# EAGLE design Handschuh (EAGLE 6.5.0)
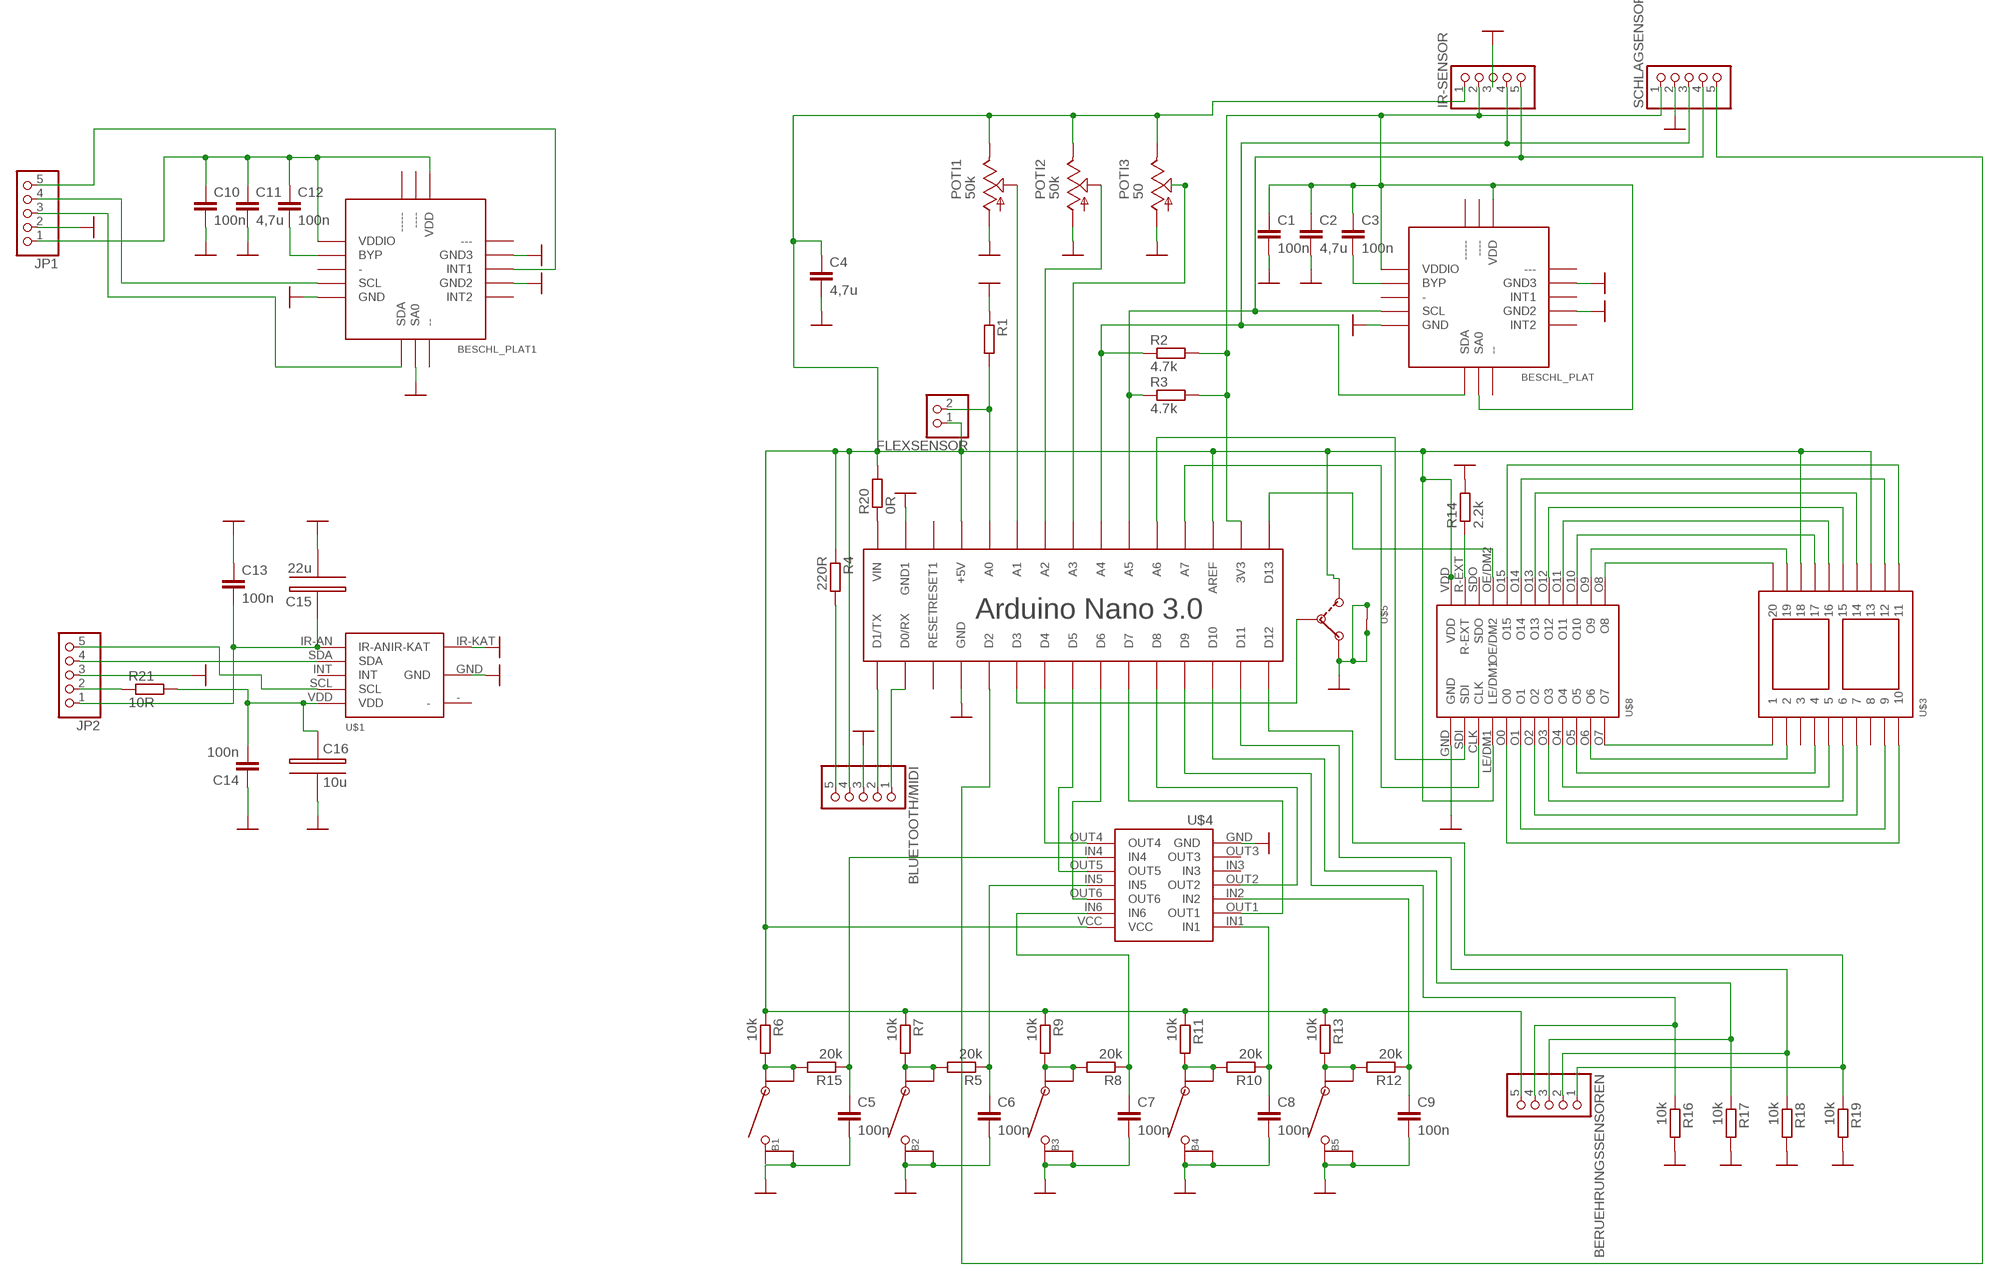
[diagram p0: schematic, sheet 1]

## Parts
B1  BUTTON  [BUTTON]
B2  BUTTON  [BUTTON]
B3  BUTTON  [BUTTON]
B4  BUTTON  [BUTTON]
B5  BUTTON  [BUTTON]
BERUEHRUNGSSENSOREN  PINHD-1X5/90  [1X05/90]
BESCHL_PLAT  BESCHLEUNIGSUNGSSENSOR  [BESCHLEUNIGUNGSSENSOR]
BESCHL_PLAT1  BESCHLEUNIGSUNGSSENSOR  [BESCHLEUNIGUNGSSENSOR]
BLUETOOTH/MIDI  PINHD-1X5/90  [1X05/90]
C1  100n  C-EUC0805  [C0805]
C2  4,7u  C-EUC0805  [C0805]
C3  100n  C-EUC0805  [C0805]
C4  4,7u  C-EUC0805  [C0805]
C5  100n  C-EUC0805  [C0805]
C6  100n  C-EUC0805  [C0805]
C7  100n  C-EUC0805  [C0805]
C8  100n  C-EUC0805  [C0805]
C9  100n  C-EUC0805  [C0805]
C10  100n  C-EUC0805  [C0805]
C11  4,7u  C-EUC0805  [C0805]
C12  100n  C-EUC0805  [C0805]
C13  100n  C-EUC0805  [C0805]
C14  100n  C-EUC0805  [C0805]
C15  22u  22U-KONDENSATOR  [22U-KONDENSATOR]
C16  10u  22U-KONDENSATOR  [22U-KONDENSATOR]
FLEXSENSOR  PINHD-1X2/90  [1X02/90]
IR-SENSOR  PINHD-1X5/90  [1X05/90]
JP1  PINHD-1X5/90  [1X05/90]
JP2  PINHD-1X5/90  [1X05/90]
POTI1  50k  POTI  [POTI]
POTI2  50k  POTI  [POTI]
POTI3  50  POTI  [POTI]
R1  R-EU_M0805  [M0805]
R2  4.7k  R-EU_M0805  [M0805]
R3  4.7k  R-EU_M0805  [M0805]
R4  220R  R-EU_M0805  [M0805]
R5  20k  R-EU_M0805  [M0805]
R6  10k  R-EU_M0805  [M0805]
R7  10k  R-EU_M0805  [M0805]
R8  20k  R-EU_M0805  [M0805]
R9  10k  R-EU_M0805  [M0805]
R10  20k  R-EU_M0805  [M0805]
R11  10k  R-EU_M0805  [M0805]
R12  20k  R-EU_M0805  [M0805]
R13  10k  R-EU_M0805  [M0805]
R14  2.2k  R-EU_M0805  [M0805]
R15  20k  R-EU_M0805  [M0805]
R16  10k  R-EU_M0805  [M0805]
R17  10k  R-EU_M0805  [M0805]
R18  10k  R-EU_M0805  [M0805]
R19  10k  R-EU_M0805  [M0805]
R20  0R  R-EU_M0805  [M0805]
R21  10R  R-EU_M0805  [M0805]
SCHLAGSENSOR  PINHD-1X5/90  [1X05/90]
U$1  IR-SENSOR  [IR-SENSOR]
U$2  ARDUINONANO  [PDIP-32]
U$3  7-SEGMENT  [7-SEGMENT]
U$4  SCHMITT-TRIGGER  [SCHMITT-TRIGGER]
U$5  SCHALTER  [SCHALTER]
U$8  7-SEGMENT-TREIBER  [7-SEGMENT-TREIBER]

## Nets
3,3V: BESCHL_PLAT.SA0 BESCHL_PLAT.VDD BESCHL_PLAT.VDDIO C1.1 C2.1 C3.1 IR-SENSOR.2 R2.2 R3.2 SCHLAGSENSOR.1 U$2.3V3
3,3V1: BESCHL_PLAT1.VDD BESCHL_PLAT1.VDDIO C10.1 C11.1 C12.1 JP1.1
5V: BERUEHRUNGSSENSOREN.5 BLUETOOTH/MIDI.4 C4.1 FLEXSENSOR.1 IR-SENSOR.1 POTI1.VCC POTI2.VCC POTI3.VCC R4.1 R6.1 R7.1 R9.1 R11.1 R13.1 R20.2 U$2.+5V U$2.AREF U$3.13 U$3.18 U$4.VCC U$5.3 U$8.LE/DM1 U$8.VDD
GND: B1.2 B2.2 B3.2 B4.2 B5.2 BESCHL_PLAT1.GND BESCHL_PLAT1.GND2 BESCHL_PLAT1.GND3 BESCHL_PLAT1.SA0 BESCHL_PLAT.GND BESCHL_PLAT.GND2 BESCHL_PLAT.GND3 BLUETOOTH/MIDI.3 C1.2 C2.2 C4.2 C5.2 C6.2 C7.2 C8.2 C9.2 C10.2 C11.2 C13.1 C14.1 C15.- C16.- IR-SENSOR.3 JP1.2 JP2.3 POTI1.GND POTI2.GND POTI3.GND R1.1 R14.2 R16.2 R17.2 R18.2 R19.2 SCHLAGSENSOR.2 U$1.GND U$1.IR-KAT U$2.GND U$2.GND1 U$4.GND U$5.1 U$5.4 U$5.5 U$8.GND
N$1: R20.1 U$2.VIN
N$2: BESCHL_PLAT1.BYP C12.2
N$3: B1.3 B1.4 R6.2 R15.2
N$4: FLEXSENSOR.2 R1.2 U$2.A0
N$5: BESCHL_PLAT.BYP C3.2
N$6: SCHLAGSENSOR.5 U$2.D2
N$7: POTI1.VALUE U$2.A1
N$8: POTI2.VALUE U$2.A2
N$9: POTI3.VALUE U$2.A3
N$10: BESCHL_PLAT1.SCL JP1.4
N$11: BLUETOOTH/MIDI.2 U$2.D1/TX
N$12: BLUETOOTH/MIDI.1 U$2.D0/RX
N$13: BLUETOOTH/MIDI.5 R4.2
N$14: BESCHL_PLAT1.SDA JP1.3
N$15: C6.1 R5.1 U$4.IN5
N$16: B2.3 B2.4 R5.2 R7.2
N$17: C7.1 R8.1 U$4.IN6
N$18: B3.3 B3.4 R8.2 R9.2
N$19: C8.1 R10.1 U$4.IN1
N$20: B4.3 B4.4 R10.2 R11.2
N$21: C9.1 R12.1 U$4.IN2
N$22: B5.3 B5.4 R12.2 R13.2
N$23: U$2.D4 U$4.OUT4
N$24: U$2.D5 U$4.OUT5
N$25: U$2.D6 U$4.OUT6
N$26: U$2.D7 U$4.OUT1
N$27: U$2.D8 U$4.OUT2
N$28: U$2.A6 U$8.SDI
N$29: C5.1 R15.1 U$4.IN4
N$30: U$2.A7 U$8.CLK
N$31: U$3.9 U$8.O1
N$32: U$3.1 U$8.O7
N$33: U$3.2 U$8.O6
N$34: U$3.4 U$8.O5
N$35: U$3.5 U$8.O4
N$36: U$3.6 U$8.O3
N$37: U$3.7 U$8.O2
N$38: U$3.10 U$8.O0
N$39: U$3.20 U$8.O8
N$40: U$3.19 U$8.O9
N$41: U$3.17 U$8.O10
N$42: U$3.16 U$8.O11
N$43: U$3.15 U$8.O12
N$44: U$3.14 U$8.O13
N$45: U$3.12 U$8.O14
N$46: U$3.11 U$8.O15
N$47: BERUEHRUNGSSENSOREN.4 R16.1 U$2.D9
N$48: R14.1 U$8.R-EXT
N$49: U$2.D13 U$8.OE/DM2
N$50: BESCHL_PLAT1.INT1 JP1.5
N$51: BERUEHRUNGSSENSOREN.3 R17.1 U$2.D10
N$52: BERUEHRUNGSSENSOREN.2 R18.1 U$2.D11
N$53: BERUEHRUNGSSENSOREN.1 R19.1 U$2.D12
N$54: U$2.D3 U$5.2
N$55: BESCHL_PLAT.SCL IR-SENSOR.5 R3.1 SCHLAGSENSOR.4 U$2.A5
N$56: C13.2 C15.+ JP2.1 U$1.IR-AN
N$57: C14.2 C16.+ R21.2 U$1.VDD
N$58: BESCHL_PLAT.SDA IR-SENSOR.4 R2.1 SCHLAGSENSOR.3 U$2.A4
N$59: JP2.2 R21.1
N$60: JP2.4 U$1.SDA
N$61: JP2.5 U$1.SCL
Unconnected: B1.1 B2.1 B3.1 B4.1 B5.1 BESCHL_PLAT1.- BESCHL_PLAT1.-- BESCHL_PLAT1.--- BESCHL_PLAT1.---- BESCHL_PLAT1.----- BESCHL_PLAT1.INT2 BESCHL_PLAT.- BESCHL_PLAT.-- BESCHL_PLAT.--- BESCHL_PLAT.---- BESCHL_PLAT.----- BESCHL_PLAT.INT1 BESCHL_PLAT.INT2 U$1.- U$1.INT U$2.RESET U$2.RESET1 U$3.3 U$3.8 U$4.IN3 U$4.OUT3 U$8.SDO

## Notes on the sheet
- Arduino Nano 3.0

## Library data of the parts
B1-B5 = Handschuh:BUTTON
BERUEHRUNGSSENSOREN BLUETOOTH/MIDI IR-SENSOR JP1 JP2 SCHLAGSENSOR = pinhead_wurz-kompatibel:PINHD-1X5: PIN HEADER
BESCHL_PLAT BESCHL_PLAT1 = beschleunigungssensor:BESCHLEUNIGSUNGSSENSOR
C1-C14 = rcl:C-EU: CAPACITOR, European symbol
C15 C16 = Handschuh:22U-KONDENSATOR
FLEXSENSOR = pinhead_wurz-kompatibel:PINHD-1X2: PIN HEADER
POTI1-POTI3 = Poti:POTI
R1-R21 = rcl:R-EU_: RESISTOR, European symbol
U$1 = Handschuh:IR-SENSOR
U$2 = jet-lib2:ARDUINONANO
U$3 = Handschuh:7-SEGMENT
U$4 = Handschuh:SCHMITT-TRIGGER
U$5 = Handschuh:SCHALTER
U$8 = Handschuh:7-SEGMENT-TREIBER

## Board
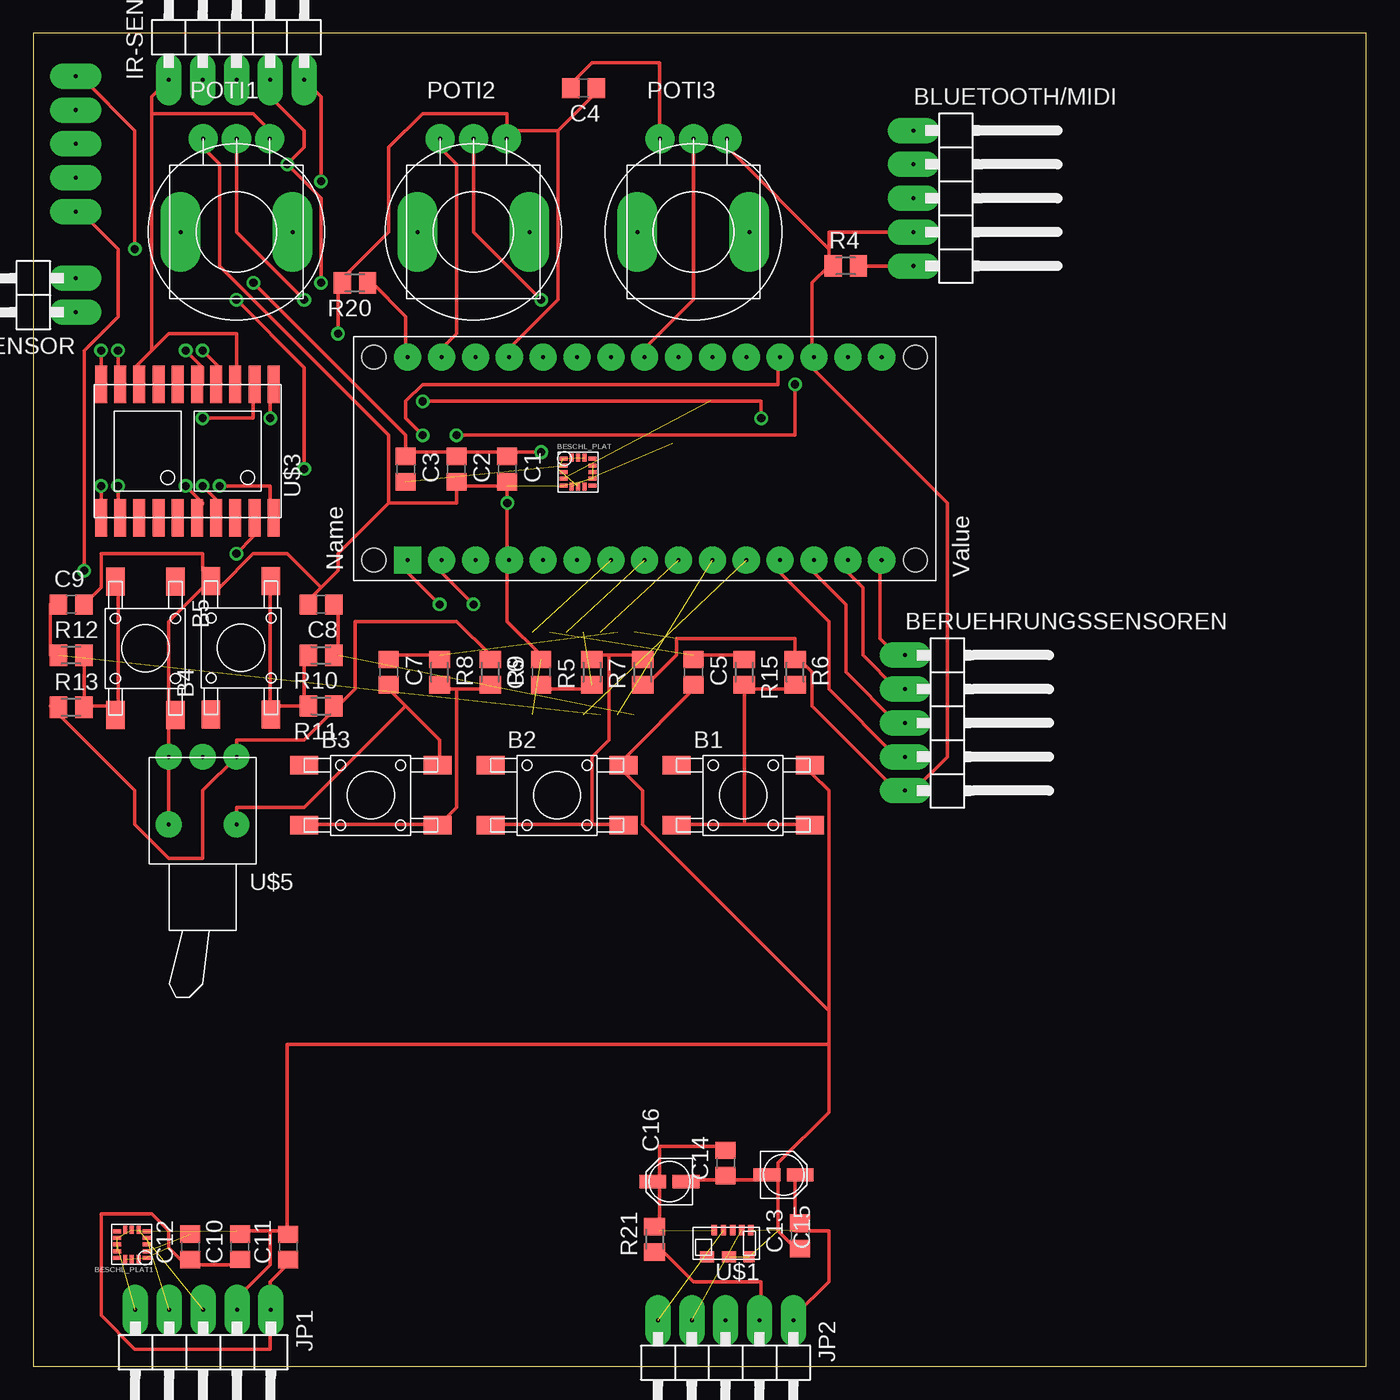
[diagram p1: board, top side]
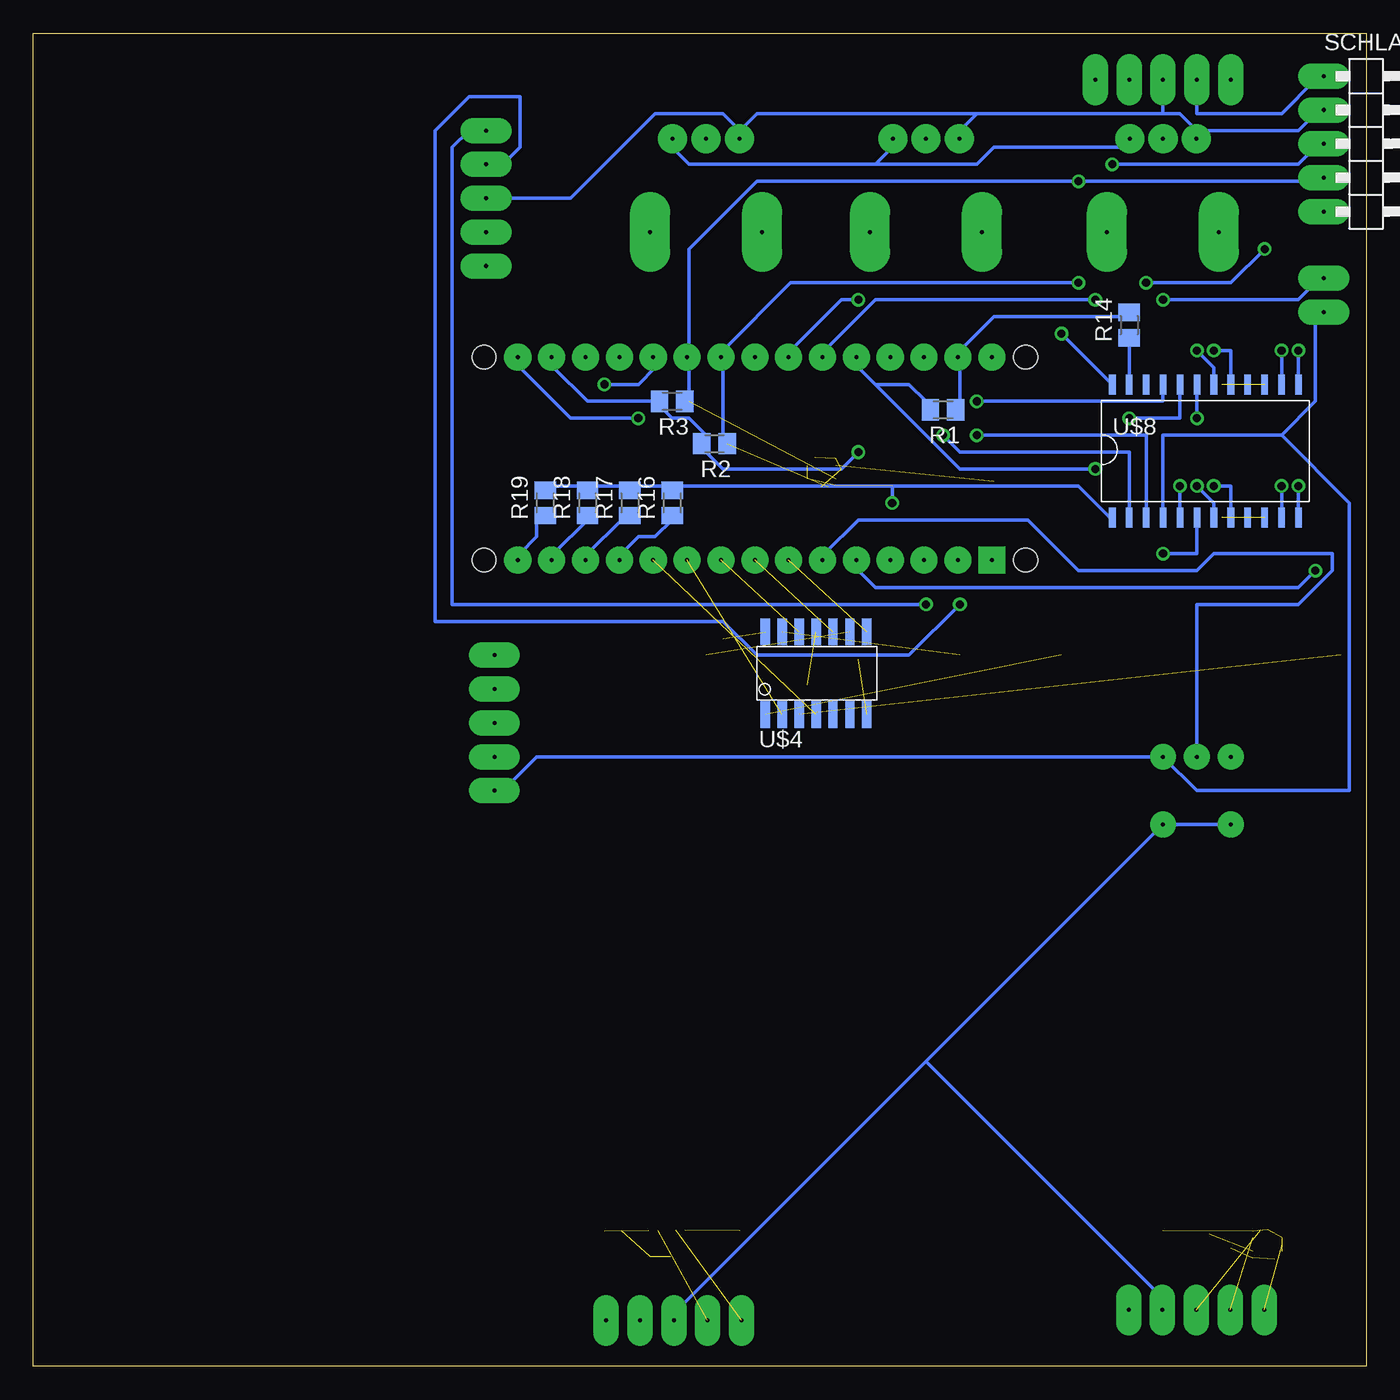
[diagram p2: board, bottom side, seen from below]

Size 100 x 100 mm. Coordinates in mm from the lower left corner, seen from the top.
Outline: 0,0 100,0 100,100 0,100 0,0
Copper layers (1*16): Top 0.035mm / dielectric 1.5mm / Bottom 0.035mm
Design rules "default *": minimum track width 10mil, minimum drill 24mil, track to track 8mil, track to pad 8mil, pad to pad 5mil, via to via 8mil, smd to smd 8mil, copper to edge 40mil, drill to drill 8mil, minimum pad ring 10mil, minimum via ring 8mil, stop-mask expansion 4mil, vias tented up to drill 0mil, thermal gap 10mil

### Footprints (pad centres in the part's own frame; a part is rotated, then mirrored left to right if it is on the bottom)
BUTTON = smd 2.1 x 1.4: 1 0,0; 2 10,0; 3 0,-4.5; 4 10,-4.5
1X05/90 = drill 0.305 pad 1.93 long: 1 -5.08,-3.81; 2 -2.54,-3.81; 3 0,-3.81; 4 2.54,-3.81; 5 5.08,-3.81
BESCHLEUNIGUNGSSENSOR = smd 0.61 x 0.305: - 0.4,-1.5; --- 2.6,-0.5; BYP 0.4,-1; GND 0.4,-2.5; GND2 2.6,-2; GND3 2.6,-1; INT1 2.6,-1.5; INT2 2.6,-2.5; SCL 0.4,-2; VDDIO 0.4,-0.5 | smd 0.305 x 0.61: -- 2,-2.6; ---- 1.5,-0.4; ----- 1,-0.4; SA0 1.5,-2.6; SDA 1,-2.6; VDD 2,-0.4
C0805 = smd 1.3 x 1.5: 1 -0.95,0; 2 0.95,0
22U-KONDENSATOR = smd 1 x 2: + 0,-0.5; - 0,-3
1X02/90 = drill 0.305 pad 1.93 long: 1 -1.27,-3.81; 2 1.27,-3.81
POTI = drill 0.305 pad 3 long: FIX1 -4.2,0; FIX2 4.2,0 | drill 0.305 pad 2.184: GND -2.5,7; VALUE 0,7; VCC 2.5,7
M0805 = smd 1.3 x 1.6: 1 -0.95,0; 2 0.95,0
IR-SENSOR = smd 1.05 x 0.8: - 3.925,-0.2; GND 2.275,-0.2 | smd 0.4 x 0.8: INT 2.02,-2.2; IR-AN 0.65,-2.2; SCL 2.705,-2.2; SDA 1.335,-2.2; VDD 3.39,-2.2 | smd 0.83 x 0.8: IR-KAT 0.785,-0.2
PDIP-32 = drill 0.305 pad 2.032: 3V3 15.24,-35.56; +5V 15.24,-10.16; A0 15.24,-12.7; A1 15.24,-15.24; A2 15.24,-17.78; A3 15.24,-20.32; A4 15.24,-22.86; A5 15.24,-25.4; A6 15.24,-27.94; A7 15.24,-30.48; AREF 15.24,-33.02; D0/RX 0,-5.08; D2 0,-12.7; D3 0,-15.24; D4 0,-17.78; D5 0,-20.32; D6 0,-22.86; D7 0,-25.4; D8 0,-27.94; D9 0,-30.48; D10 0,-33.02; D11 0,-35.56; D12 0,-38.1; D13 15.24,-38.1; GND 0,-10.16; GND1 15.24,-5.08; RESET 0,-7.62; RESET1 15.24,-7.62; VIN 15.24,-2.54 | drill 0.305 pad 2.032 square: D1/TX 0,-2.54 | hole 1.778: 0,0; 0,-40.64; 15.24,-40.64; 15.24,0
7-SEGMENT = smd 0.9 x 2.8: 1 0,-10; 2 1.44,-10; 3 2.88,-10; 4 4.32,-10; 5 5.76,-10; 6 7.2,-10; 7 8.64,-10; 8 10.08,-10; 9 11.52,-10; 10 12.96,-10; 11 12.96,0; 12 11.52,0; 13 10.08,0; 14 8.64,0; 15 7.2,0; 16 5.76,0; 17 4.32,0; 18 2.88,0; 19 1.44,0; 20 0,0
SCHMITT-TRIGGER = smd 0.7 x 2: GND 7.62,0; IN1 0,0; IN2 2.54,0; IN3 5.08,0; IN4 6.35,6.2; IN5 3.81,6.2; IN6 1.27,6.2; OUT1 1.27,0; OUT2 3.81,0; OUT3 6.35,0; OUT4 7.62,6.2; OUT5 5.08,6.2; OUT6 2.54,6.2; VCC 0,6.2
SCHALTER = drill 0.305 pad 1.93: 1 -2.54,2.54; 2 0,2.54; 3 2.54,2.54; 4 -2.54,-2.54; 5 2.54,-2.54
7-SEGMENT-TREIBER = smd 0.5 x 1.5: CLK -11.43,-10; GND -13.97,-10; LE/DM1 -10.16,-10; O0 -8.89,-10; O1 -7.62,-10; O2 -6.35,-10; O3 -5.08,-10; O4 -3.81,-10; O5 -2.54,-10; O6 -1.27,-10; O7 0,-10; O8 0,0; O9 -1.27,0; O10 -2.54,0; O11 -3.81,0; O12 -5.08,0; O13 -6.35,0; O14 -7.62,0; O15 -8.89,0; OE/DM2 -10.16,0; R-EXT -12.7,0; SDI -12.7,-10; SDO -11.43,0; VDD -13.97,0

### Placement (x,y rotation side)
B1  48.26,45.09 0 top
B2  34.29,45.09 0 top
B3  20.32,45.09 0 top
B4  13.34,48.9 90 top
B5  10.66,58.85 270 top
BERUEHRUNGSSENSOREN  69.22,48.26 270 top
BESCHL_PLAT  39.37,68.58 0 top
BESCHL_PLAT1  8.9,7.63 180 top
BLUETOOTH/MIDI  69.85,87.63 270 top
C1  35.56,67.31 270 top
C2  31.75,67.31 270 top
C3  27.94,67.31 270 top
C4  41.27,95.89 180 top
C5  49.53,52.07 270 top
C6  38.1,52.07 90 top
C7  26.67,52.07 270 top
C8  21.59,57.15 180 top
C9  2.84,57.15 0 top
C10  15.5,8.97 90 top
C11  19.12,8.95 90 top
C12  11.78,8.96 90 top
C13  57.53,9.78 90 top
C14  51.94,15.24 90 top
C15  58.04,14.35 270 top
C16  45.97,13.84 90 top
FLEXSENSOR  -0.64,80.35 90 top
IR-SENSOR  15.24,100.33 0 top
JP1  12.74,0.41 180 top
JP2  51.94,-0.38 180 top
POTI1  15.24,85.09 0 top
POTI2  33.02,85.09 0 top
POTI3  49.53,85.09 0 top
R1  31.75,71.75 180 bottom
R2  48.9,69.22 180 bottom
R3  52.07,72.39 180 bottom
R4  60.96,82.55 0 top
R5  41.91,52.07 90 top
R6  57.15,52.07 270 top
R7  45.72,52.07 90 top
R8  30.48,52.07 270 top
R9  34.29,52.07 270 top
R10  21.59,53.34 180 top
R11  21.59,49.53 180 top
R12  2.84,53.34 0 top
R13  2.84,49.43 0 top
R14  17.78,78.11 90 bottom
R15  53.34,52.07 270 top
R16  52.07,64.77 90 bottom
R17  55.24,64.77 90 bottom
R18  58.42,64.77 90 bottom
R19  61.59,64.77 90 bottom
R20  24.13,81.28 180 top
R21  46.61,9.53 90 top
SCHLAGSENSOR  -0.64,91.71 270 bottom
U$1  54.48,8 180 top
U$2  25.55,60.47 90 top
U$3  5.08,73.66 0 top
U$4  45.09,48.9 0 bottom
U$5  12.7,43.18 0 top
U$8  5.08,73.66 0 bottom

### Tracks (layer width: path | path; a pad name or v marks a point on that pad's centre or on a via)
3,3V  (via drill 0.61)  (3 unrouted)
  Top 0.254: 31.75,68.58 27.94,68.58 | 31.75,68.58 35.56,68.58 | 31.75,68.58 C2.1 | v38.1,68.58 35.56,68.58 | 35.56,68.58 C1.1 | v7.62,83.82 7.62,92.71 3.81,96.52 SCHLAGSENSOR.1 | v16.51,81.28 27.94,69.85 27.94,68.58 | 27.94,68.58 C3.1
  Bottom 0.254: IR-SENSOR.2 12.7,93.98 6.35,93.98 3.81,96.52 SCHLAGSENSOR.1 | 53.34,72.39 52.07,71.12 50.8,71.12 49.53,69.85 R2.2 49.53,68.58 48.26,67.31 39.37,67.31 v38.1,68.58 | 53.34,72.39 58.42,72.39 60.96,74.93 U$2.3V3 | 53.34,72.39 R3.2 | v7.62,83.82 10.16,81.28 v16.51,81.28
3,3V1  (2 unrouted)
  Top 0.254: 11.43,7.62 15.24,7.62 C10.1 | C11.1 19.05,7.62 17.78,6.35 17.78,5.08 JP1.1 17.78,3.81 17.78,1.27 7.62,1.27 5.08,3.81 5.08,11.43 8.89,11.43 10.16,10.16 10.16,8.89 11.43,7.62 | 11.43,7.62 C12.1
5V  (via drill 0.61)  (1 unrouted)
  Top 0.254: 8.89,76.2 10.16,77.47 15.24,77.47 15.24,73.66 U$3.13 | 8.89,76.2 7.62,74.93 7.62,73.66 U$3.18 | IR-SENSOR.1 8.89,95.25 8.89,93.98 | 8.89,76.2 8.89,93.98 | 8.89,93.98 16.51,93.98 17.78,92.71 POTI1.VCC | 59.69,82.55 58.42,81.28 58.42,76.2 U$2.AREF 58.42,74.93 68.58,64.77 68.58,45.72 66.04,43.18 BERUEHRUNGSSENSOREN.5 64.77,43.18 58.42,49.53 58.42,52.07 57.15,53.34 | BLUETOOTH/MIDI.4 59.69,85.09 59.69,83.82 | 59.69,82.55 59.69,83.82 | 59.69,82.55 R4.1 | 59.69,83.82 52.07,91.44 POTI3.VCC | 22.86,81.28 v22.86,77.47 | 39.37,92.71 41.91,95.25 C4.1 | 35.56,92.71 39.37,92.71 | 39.37,92.71 39.37,80.01 35.56,76.2 U$2.+5V | 22.86,81.28 26.67,85.09 26.67,91.44 29.21,93.98 35.56,93.98 35.56,92.71 | 22.86,81.28 R20.2 | 35.56,92.71 POTI2.VCC | 57.15,53.34 57.15,54.61 48.26,54.61 48.26,53.34 45.72,50.8 R7.1 | 57.15,53.34 R6.1 | R13.1 1.27,49.53 7.62,43.18 7.62,40.64 10.16,38.1 12.7,38.1 12.7,43.18 U$5.3 15.24,46.99 20.32,46.99 22.86,49.53 | 22.86,49.53 24.13,50.8 24.13,55.88 31.75,55.88 34.29,53.34 R9.1 | 22.86,49.53 R11.1
  Bottom 0.254: v22.86,77.47 U$8.VDD | 36.83,90.17 50.8,90.17 52.07,91.44 POTI3.VCC | 36.83,90.17 35.56,91.44 POTI2.VCC | 36.83,90.17 29.21,90.17 27.94,91.44 17.78,91.44 POTI1.VCC | 6.35,69.85 15.24,69.85 U$8.LE/DM1 15.24,63.5 | 6.35,69.85 3.81,72.39 3.81,78.74 FLEXSENSOR.1 | 6.35,69.85 1.27,64.77 1.27,43.18 12.7,43.18 U$5.3 62.23,45.72 64.77,43.18 BERUEHRUNGSSENSOREN.5
GND  (via drill 0.61)  (10 unrouted)
  Top 0.254: C4.2 40.64,96.52 41.91,97.79 46.99,97.79 46.99,92.71 POTI3.GND | U$2.GND1 30.48,76.2 31.75,77.47 31.75,90.17 30.48,91.44 POTI2.GND | C5.2 49.53,50.8 44.45,45.72 B2.2 44.45,44.45 45.72,43.18 45.72,40.64 59.69,26.67 | 52.07,13.97 49.53,13.97 C16.- | 55.88,13.97 55.88,10.16 57.15,8.89 C13.1 | 59.69,24.13 59.69,19.05 55.88,15.24 55.88,13.97 | 59.69,24.13 59.69,26.67 | 59.69,26.67 59.69,43.18 58.42,44.45 B1.2 | 55.88,13.97 C15.- 54.61,13.97 52.07,13.97 | 52.07,13.97 C14.1 | C6.2 38.1,53.34 35.56,55.88 35.56,59.69 U$2.GND 35.56,60.96 v35.56,64.77 35.56,66.04 | 21.59,58.42 22.86,59.69 22.86,60.96 26.67,64.77 | 21.59,58.42 20.32,57.15 C8.2 | 26.67,64.77 31.75,64.77 31.75,66.04 | 31.75,66.04 35.56,66.04 | 31.75,66.04 C2.2 | 35.56,66.04 C1.2 | 19.05,10.16 17.78,10.16 | 17.78,10.16 15.24,10.16 C10.2 | 17.78,10.16 17.78,7.62 15.24,5.08 JP1.2 | C9.2 3.81,57.15 5.08,58.42 5.08,60.96 12.7,60.96 12.7,59.69 B4.2 | 27.94,49.53 30.48,46.99 30.48,45.72 B3.2 | 27.94,49.53 26.67,50.8 C7.2 | U$5.4 U$5.1 10.16,48.26 B5.2 10.16,49.53 10.16,55.88 12.7,58.42 B4.2 | 27.94,49.53 20.32,41.91 15.24,41.91 U$5.5 | 21.59,58.42 19.05,60.96 16.51,60.96 13.97,58.42 B4.2 | 59.69,24.13 19.05,24.13 19.05,10.16 | 19.05,10.16 C11.2 | 26.67,64.77 26.67,69.85 13.97,82.55 13.97,90.17 12.7,91.44 POTI1.GND
  Bottom 0.254: BLUETOOTH/MIDI.3 59.69,87.63 53.34,93.98 48.26,93.98 46.99,92.71 | R14.2 17.78,78.74 27.94,78.74 30.48,76.2 U$2.GND1 30.48,74.93 30.48,72.39 R1.1 | 12.7,92.71 5.08,92.71 3.81,93.98 SCHLAGSENSOR.2 | 15.24,93.98 IR-SENSOR.3 | 15.24,93.98 13.97,93.98 12.7,92.71 | 12.7,92.71 POTI1.GND | 29.21,93.98 30.48,92.71 POTI2.GND | 15.24,93.98 29.21,93.98 | 46.99,92.71 45.72,93.98 29.21,93.98 | 46.99,92.71 POTI3.GND | 58.42,66.04 55.88,66.04 R17.2 54.61,66.04 52.07,66.04 | 58.42,66.04 60.96,66.04 R19.2 | 58.42,66.04 R18.2 | 52.07,66.04 35.56,66.04 | 35.56,66.04 21.59,66.04 19.05,63.5 U$8.GND | 52.07,66.04 R16.2 | U$5.4 U$5.5 33.02,22.86 | 33.02,22.86 52.07,3.81 JP2.3 | 33.02,22.86 15.24,5.08 JP1.2 | v35.56,64.77 35.56,66.04
N$1
  Top 0.254: R20.1 25.4,81.28 27.94,78.74 27.94,76.2 U$2.VIN
N$2  (1 unrouted)
N$3
  Top 0.254: 53.34,50.8 57.15,50.8 R6.2 | 53.34,40.64 58.42,40.64 B1.4 | 53.34,40.64 48.26,40.64 B1.3 | 53.34,40.64 53.34,50.8 | 53.34,50.8 R15.2
N$4  (via drill 0.61)
  Top 0.254: v15.24,80.01 20.32,74.93 v20.32,67.31
  Bottom 0.254: 36.83,73.66 34.29,73.66 33.02,72.39 R1.2 | 36.83,73.66 38.1,74.93 U$2.A0 | v15.24,80.01 5.08,80.01 3.81,81.28 FLEXSENSOR.2 | v20.32,67.31 30.48,67.31 36.83,73.66
N$5  (1 unrouted)
N$6  (via drill 0.61)
  Top 0.254: v3.81,59.69 3.81,76.2 6.35,78.74 6.35,83.82 3.81,86.36 SCHLAGSENSOR.5
  Bottom 0.254: v3.81,59.69 5.08,58.42 36.83,58.42 38.1,59.69 U$2.D2
N$7  (via drill 0.61)
  Top 0.254: v20.32,80.01 15.24,85.09 POTI1.VALUE
  Bottom 0.254: v20.32,80.01 36.83,80.01 40.64,76.2 U$2.A1
N$8  (via drill 0.61)
  Top 0.254: v38.1,80.01 33.02,85.09 POTI2.VALUE
  Bottom 0.254: v38.1,80.01 39.37,80.01 43.18,76.2 U$2.A2
N$9
  Top 0.254: POTI3.VALUE 49.53,80.01 45.72,76.2 U$2.A3
N$10  (1 unrouted)
N$11  (via drill 0.61)
  Top 0.254: v30.48,57.15 27.94,59.69 U$2.D1/TX
  Bottom 0.254: BLUETOOTH/MIDI.2 64.77,90.17 63.5,91.44 63.5,95.25 67.31,95.25 69.85,92.71 69.85,55.88 48.26,55.88 45.72,53.34 34.29,53.34 v30.48,57.15
N$12  (via drill 0.61)
  Top 0.254: v33.02,57.15 30.48,59.69 U$2.D0/RX
  Bottom 0.254: BLUETOOTH/MIDI.1 67.31,92.71 68.58,91.44 68.58,57.15 v33.02,57.15
N$13
  Top 0.254: BLUETOOTH/MIDI.5 R4.2
N$14  (1 unrouted)
N$15  (1 unrouted)
  Top 0.254: C6.1 38.1,50.8 41.91,50.8 R5.1
N$16
  Top 0.254: 43.18,53.34 45.72,53.34 R7.2 | 43.18,53.34 41.91,53.34 R5.2 | 41.91,40.64 44.45,40.64 B2.4 | 41.91,40.64 34.29,40.64 B2.3 | 43.18,53.34 43.18,46.99 41.91,45.72 41.91,40.64
N$17  (1 unrouted)
  Top 0.254: C7.1 26.67,53.34 30.48,53.34 R8.1
N$18
  Top 0.254: 31.75,50.8 34.29,50.8 R9.2 | 31.75,50.8 30.48,50.8 R8.2 | 30.48,40.64 20.32,40.64 B3.3 | 31.75,50.8 31.75,41.91 30.48,40.64 | 30.48,40.64 B3.4
N$19  (1 unrouted)
  Top 0.254: C8.1 22.86,57.15 22.86,53.34 R10.1
N$20
  Top 0.254: 17.78,49.53 20.32,49.53 | 20.32,49.53 20.32,53.34 R10.2 | 20.32,49.53 R11.2 | 17.78,49.53 17.78,58.42 B4.4 | 17.78,49.53 B4.3
N$21  (1 unrouted)
  Top 0.254: C9.1 1.27,57.15 1.27,53.34 R12.1
N$22
  Top 0.254: 6.35,49.53 3.81,49.53 | 3.81,49.53 3.81,53.34 R12.2 | 3.81,49.53 R13.2 | 6.35,49.53 6.35,58.42 B5.3 | 6.35,49.53 B5.4
N$23  (1 unrouted)
N$24  (1 unrouted)
N$25  (1 unrouted)
N$26  (1 unrouted)
N$27  (1 unrouted)
N$28  (via drill 0.61)
  Top 0.254: v31.75,69.85 57.15,69.85 v57.15,73.66
  Bottom 0.254: v31.75,69.85 30.48,68.58 17.78,68.58 U$8.SDI 17.78,63.5 | v57.15,73.66 54.61,73.66 53.34,74.93 U$2.A6
N$29  (1 unrouted)
  Top 0.254: C5.1 49.53,53.34 53.34,53.34 R15.1
N$30  (via drill 0.61)
  Top 0.254: v29.21,69.85 27.94,71.12 27.94,72.39 29.21,73.66 55.88,73.66 55.88,74.93 U$2.A7
  Bottom 0.254: v29.21,69.85 16.51,69.85 U$8.CLK 16.51,63.5
N$31  (via drill 0.61)
  Top 0.254: v15.24,60.96 16.51,62.23 16.51,63.5 U$3.9
  Bottom 0.254: U$8.O1 12.7,60.96 v15.24,60.96
N$32  (via drill 0.61)
  Top 0.254: U$8.O7 v5.08,66.04
  Bottom 0.254: v5.08,66.04 U$8.O7 5.08,63.5
N$33  (via drill 0.61)
  Top 0.254: v6.35,66.04 6.35,64.77 U$3.2
  Bottom 0.254: v6.35,66.04 U$8.O6 6.35,63.5
N$34  (1 unrouted)
N$35  (1 unrouted)
N$36  (via drill 0.61)
  Top 0.254: v11.43,66.04 12.7,64.77 U$3.6
  Bottom 0.254: v11.43,66.04 10.16,66.04 U$8.O3 10.16,63.5
N$37  (via drill 0.61)
  Top 0.254: v12.7,66.04 13.97,64.77 U$3.7
  Bottom 0.254: v12.7,66.04 11.43,64.77 U$8.O2 11.43,63.5
N$38  (via drill 0.61)
  Top 0.254: v13.97,66.04 17.78,66.04 17.78,64.77 U$3.10
  Bottom 0.254: v13.97,66.04 U$8.O0 13.97,63.5
N$39  (via drill 0.61)
  Top 0.254: U$8.O8 v5.08,76.2
  Bottom 0.254: v5.08,76.2 U$8.O8
N$40  (via drill 0.61)
  Top 0.254: v6.35,76.2 U$8.O9 U$3.19
  Bottom 0.254: v6.35,76.2 U$8.O9
N$41  (1 unrouted)
N$42  (1 unrouted)
N$43  (via drill 0.61)
  Top 0.254: v11.43,76.2 12.7,74.93 12.7,73.66 U$3.15
  Bottom 0.254: U$8.O12 10.16,76.2 v11.43,76.2
N$44  (via drill 0.61)
  Top 0.254: v12.7,76.2 13.97,74.93 13.97,73.66 U$3.14
  Bottom 0.254: U$8.O13 11.43,74.93 v12.7,76.2
N$45  (via drill 0.61)
  Top 0.254: v12.7,71.12 16.51,71.12 16.51,73.66 U$3.12
  Bottom 0.254: v12.7,71.12 U$8.O14
N$46  (via drill 0.61)
  Top 0.254: v17.78,71.12 17.78,73.66 U$3.11
  Bottom 0.254: U$8.O15 13.97,71.12 v17.78,71.12
N$47
  Top 0.254: BERUEHRUNGSSENSOREN.4 64.77,45.72 59.69,50.8 59.69,55.88 55.88,59.69 U$2.D9
  Bottom 0.254: R16.1 52.07,63.5 53.34,62.23 54.61,62.23 55.88,60.96 U$2.D9
N$48
  Bottom 0.254: U$8.R-EXT R14.1 17.78,77.47
N$49  (via drill 0.61)
  Top 0.254: v29.21,72.39 54.61,72.39 v54.61,71.12
  Bottom 0.254: U$8.OE/DM2 15.24,72.39 v29.21,72.39 | v54.61,71.12 59.69,71.12 63.5,74.93 U$2.D13
N$50  (1 unrouted)
N$51
  Top 0.254: BERUEHRUNGSSENSOREN.3 64.77,48.26 60.96,52.07 60.96,57.15 58.42,59.69 U$2.D10
  Bottom 0.254: R17.1 55.88,63.5 58.42,60.96 U$2.D10
N$52
  Top 0.254: BERUEHRUNGSSENSOREN.2 64.77,50.8 62.23,53.34 62.23,58.42 60.96,59.69 U$2.D11
  Bottom 0.254: R18.1 58.42,63.5 60.96,60.96 U$2.D11
N$53
  Top 0.254: BERUEHRUNGSSENSOREN.1 64.77,53.34 63.5,54.61 63.5,59.69 U$2.D12
  Bottom 0.254: R19.1 62.23,63.5 62.23,62.23 63.5,60.96 U$2.D12
N$54
  Bottom 0.254: U$5.2 12.7,57.15 5.08,57.15 2.54,59.69 2.54,60.96 11.43,60.96 12.7,59.69 21.59,59.69 25.4,63.5 38.1,63.5 40.64,60.96 U$2.D3
N$55  (via drill 0.61)  (1 unrouted)
  Top 0.254: IR-SENSOR.5 21.59,95.25 v21.59,88.9
  Bottom 0.254: R3.1 50.8,72.39 50.8,74.93 U$2.A5 50.8,76.2 50.8,83.82 45.72,88.9 v21.59,88.9 3.81,88.9 SCHLAGSENSOR.4
N$56  (1 unrouted)
  Top 0.254: 57.15,10.16 57.15,13.97 C15.+ | 57.15,10.16 59.69,10.16 59.69,6.35 57.15,3.81 JP2.1 | 57.15,10.16 C13.2
N$57  (1 unrouted)
  Top 0.254: 46.99,13.97 46.99,16.51 52.07,16.51 C14.2 | 46.99,13.97 46.99,10.16 R21.2 | 46.99,13.97 C16.+
N$58  (via drill 0.61)  (1 unrouted)
  Top 0.254: IR-SENSOR.4 17.78,95.25 20.32,92.71 20.32,91.44 v19.05,90.17 21.59,87.63 v21.59,81.28
  Bottom 0.254: R2.1 48.26,69.85 48.26,74.93 U$2.A4 48.26,76.2 43.18,81.28 v21.59,81.28 | v19.05,90.17 5.08,90.17 3.81,91.44 SCHLAGSENSOR.3
N$59
  Top 0.254: R21.1 46.99,8.89 49.53,6.35 54.61,6.35 54.61,3.81 JP2.2
N$60  (1 unrouted)
N$61  (1 unrouted)